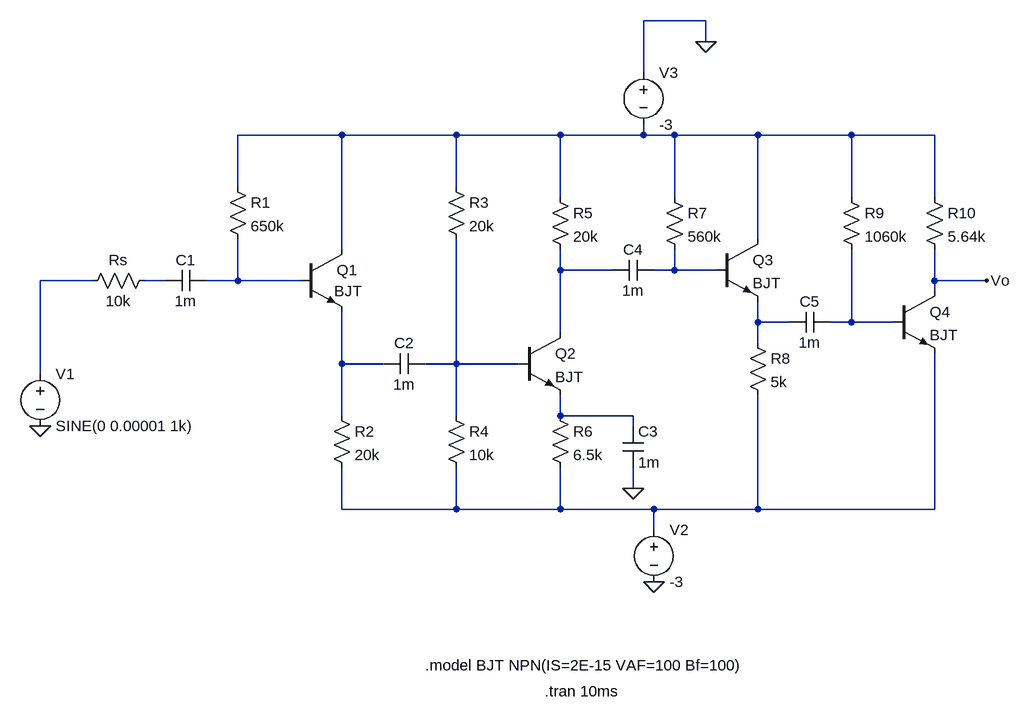
[diagram p0: schematic project1.asc]
project1.asc, the LTspice schematic file:
Version 4
SHEET 1 2228 712
WIRE 592 -336 496 -336
WIRE 592 -304 592 -336
WIRE 496 -256 496 -336
WIRE 32 -160 -128 -160
WIRE 208 -160 32 -160
WIRE 368 -160 208 -160
WIRE 496 -160 496 -176
WIRE 496 -160 368 -160
WIRE 544 -160 496 -160
WIRE 672 -160 544 -160
WIRE 816 -160 672 -160
WIRE 944 -160 816 -160
WIRE -128 -80 -128 -160
WIRE 208 -80 208 -160
WIRE 368 -64 368 -160
WIRE 544 -64 544 -160
WIRE 816 -64 816 -160
WIRE 944 -64 944 -160
WIRE 672 0 672 -160
WIRE 32 16 32 -160
WIRE 368 48 368 16
WIRE 448 48 368 48
WIRE 544 48 544 16
WIRE 544 48 512 48
WIRE 608 48 544 48
WIRE -352 64 -432 64
WIRE -240 64 -272 64
WIRE -128 64 -128 0
WIRE -128 64 -176 64
WIRE -32 64 -128 64
WIRE 944 64 944 16
WIRE 1024 64 944 64
WIRE 944 80 944 64
WIRE 672 128 672 96
WIRE 720 128 672 128
WIRE 816 128 816 16
WIRE 816 128 784 128
WIRE 880 128 816 128
WIRE 368 144 368 48
WIRE 672 160 672 128
WIRE 32 192 32 112
WIRE 96 192 32 192
WIRE 208 192 208 0
WIRE 208 192 160 192
WIRE 304 192 208 192
WIRE -432 208 -432 64
WIRE 32 272 32 192
WIRE 208 272 208 192
WIRE 368 272 368 240
WIRE 480 272 368 272
WIRE 480 288 480 272
WIRE 480 384 480 352
WIRE 32 416 32 352
WIRE 208 416 208 352
WIRE 208 416 32 416
WIRE 368 416 368 352
WIRE 368 416 208 416
WIRE 512 416 368 416
WIRE 672 416 672 240
WIRE 672 416 512 416
WIRE 944 416 944 176
WIRE 944 416 672 416
WIRE 512 448 512 416
FLAG -432 288 0
FLAG 512 528 0
FLAG 1024 64 Vo
FLAG 480 384 0
FLAG 592 -304 0
SYMBOL npn 304 144 R0
SYMATTR InstName Q2
SYMATTR Value BJT
SYMBOL npn -32 16 R0
WINDOW 3 52 64 Left 2
SYMATTR Value BJT
SYMATTR InstName Q1
SYMBOL voltage -432 192 R0
WINDOW 123 0 0 Left 0
WINDOW 39 0 0 Left 0
SYMATTR InstName V1
SYMATTR Value SINE(0 0.00001 1k)
SYMBOL res -256 48 R90
WINDOW 0 0 56 VBottom 2
WINDOW 3 32 56 VTop 2
SYMATTR InstName Rs
SYMATTR Value 10k
SYMBOL cap -176 48 R90
WINDOW 0 0 32 VBottom 2
WINDOW 3 32 32 VTop 2
SYMATTR InstName C1
SYMATTR Value 1m
SYMBOL res -144 -96 R0
SYMATTR InstName R1
SYMATTR Value 650k
SYMBOL res 192 256 R0
SYMATTR InstName R4
SYMATTR Value 10k
SYMBOL res 16 256 R0
SYMATTR InstName R2
SYMATTR Value 20k
SYMBOL cap 160 176 R90
WINDOW 0 0 32 VBottom 2
WINDOW 3 32 32 VTop 2
SYMATTR InstName C2
SYMATTR Value 1m
SYMBOL res 192 -96 R0
SYMATTR InstName R3
SYMATTR Value 20k
SYMBOL res 352 -80 R0
SYMATTR InstName R5
SYMATTR Value 20k
SYMBOL res 352 256 R0
SYMATTR InstName R6
SYMATTR Value 6.5k
SYMBOL cap 464 288 R0
SYMATTR InstName C3
SYMATTR Value 1m
SYMBOL cap 512 32 R90
WINDOW 0 0 32 VBottom 2
WINDOW 3 32 32 VTop 2
SYMATTR InstName C4
SYMATTR Value 1m
SYMBOL npn 608 0 R0
SYMATTR InstName Q3
SYMATTR Value BJT
SYMBOL res 528 -80 R0
SYMATTR InstName R7
SYMATTR Value 560k
SYMBOL res 656 144 R0
SYMATTR InstName R8
SYMATTR Value 5k
SYMBOL cap 784 112 R90
WINDOW 0 0 32 VBottom 2
WINDOW 3 32 32 VTop 2
SYMATTR InstName C5
SYMATTR Value 1m
SYMBOL res 800 -80 R0
SYMATTR InstName R9
SYMATTR Value 1060k
SYMBOL res 928 -80 R0
SYMATTR InstName R10
SYMATTR Value 5.64k
SYMBOL npn 880 80 R0
SYMATTR InstName Q4
SYMATTR Value BJT
SYMBOL voltage 512 432 R0
WINDOW 123 0 0 Left 0
WINDOW 39 0 0 Left 0
SYMATTR InstName V2
SYMATTR Value -3
SYMBOL voltage 496 -272 R0
WINDOW 123 0 0 Left 0
WINDOW 39 0 0 Left 0
SYMATTR InstName V3
SYMATTR Value -3
TEXT 160 656 Left 2 !.model BJT NPN(IS=2E-15 VAF=100 Bf=100)
TEXT 344 696 Left 2 !.tran 10ms

The netlist it stands for:
* project1.asc
Q2 N002 N010 N011 0 BJT
Q1 N001 N006 N009 0 BJT
V1 N004 0 SINE(0 0.00001 1k)
Rs N005 N004 10k
C1 N006 N005 1m
R1 N001 N006 650k
R4 N010 N012 10k
R2 N009 N012 20k
C2 N010 N009 1m
R3 N001 N010 20k
R5 N001 N002 20k
R6 N011 N012 6.5k
C3 N011 0 1m
C4 N003 N002 1m
Q3 N001 N003 N007 0 BJT
R7 N001 N003 560k
R8 N007 N012 5k
C5 N008 N007 1m
R9 N001 N008 1060k
R10 N001 Vo 5.64k
Q4 Vo N008 N012 0 BJT
V2 N012 0 -3
V3 0 N001 -3
.model NPN NPN
.model PNP PNP
.lib standard.bjt
.model BJT NPN(IS=2E-15 VAF=100 Bf=100)
.tran 10ms
.backanno
.end